# Altium schematic sheet FAN.SchDoc
size A4
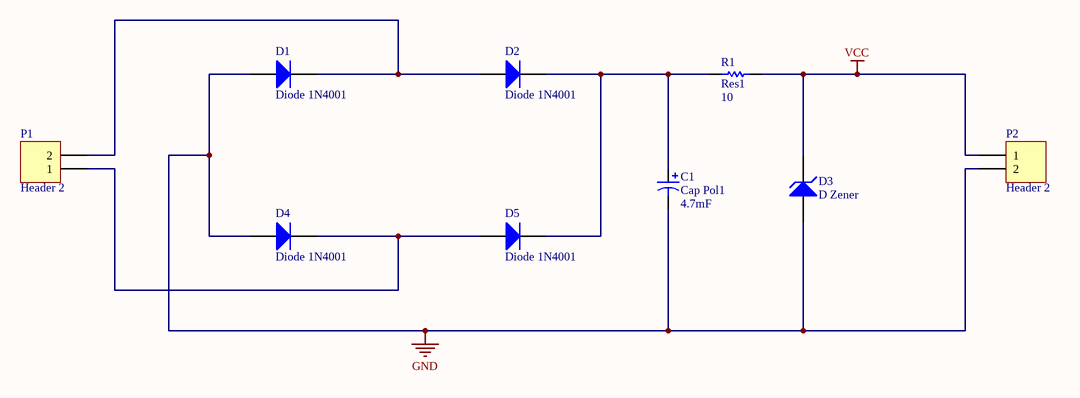
[diagram p0: FAN.SchDoc]

## Parts
C1  Cap Pol1  value 4.7mF  [RB7.6-15]
D1  Diode 1N4001  [DO-41]
D2  Diode 1N4001  [DO-41]
D3  D Zener  [DIODE-0.7]
D4  Diode 1N4001  [DO-41]
D5  Diode 1N4001  [DO-41]
P1  Header 2  [HDR1X2]
P2  Header 2  [HDR1X2]
R1  Res1  value 10  [AXIAL-0.3]

## Nets
GND: C1.2 D1.1(A) D3.1(A) D4.1(A) P2.2
VCC: D3.2(K) P2.1 R1.2
NetC1_1: C1.1 D2.2(K) D5.2(K) R1.1
NetD1_2: D1.2(K) D2.1(A) P1.2
NetD4_2: D4.2(K) D5.1(A) P1.1

## Library data of the parts
C1 = Cap Pol1: Polarized Capacitor (Radial); Published: 8-Jun-2000; LatestRevisionDate: 17-Jul-2002; LatestRevisionNote: Re-released for DXP Platform.; PackageReference: RB7.6-15; Publisher: Altium Limited; PackageDescription: Polarized Capacitor (Radial); 2 Leads
D1 D2 D4 D5 = Diode 1N4001: 1 Amp General Purpose Rectifier; Published: 8-Jun-2000; LatestRevisionDate: 17-Jul-2002; LatestRevisionNote: Re-released for DXP Platform.; DatasheetVersion: 1998; PackageVersion: Aug-1999; PackageReference: DO-41; Publisher: Altium Limited; PackageDescription: Diode, Axial; Body 5.2 x 2.7 mm (LxDia. max), Lead Dia. 0.86 mm (max); Code_JEDEC: DO-204-AL; ComponentLink1Description: Manufacturer Link; ComponentLink1URL: http://www.fairchildsemi.com/; ComponentLink2Description: Datasheet; ComponentLink2URL: http://www.fairchildsemi.com/ds/1N%2F1N4001.pdf
D3 = D Zener: Zener Diode; Published: 8-Jun-2000; LatestRevisionDate: 17-Jul-2002; LatestRevisionNote: Re-released for DXP Platform.; PackageReference: DIODE-0.7; Publisher: Altium Limited; PackageDescription: Diode, Thru-Hole; 2 Leads; 0.7 in Pin Spacing
P1 P2 = Header 2: Header, 2-Pin; LatestRevisionDate: 17-Jul-2002; LatestRevisionNote: Re-released for DXP Platform.; Publisher: Altium Limited
R1 = Res1: Resistor; Published: 8-Jun-2000; LatestRevisionDate: 17-Jul-2002; LatestRevisionNote: Re-released for DXP Platform.; PackageReference: AXIAL-0.3; Publisher: Altium Limited; PackageDescription: Axial Device, Thru-Hole; 2 Leads; 0.3 in Pin Spacing